# Altium schematic sheet 91302-42-067RDM1_91302-42-067RDM.schdoc.schdoc
size 127 x 111 mm
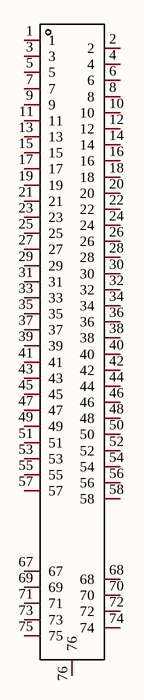
[diagram p0: 91302-42-067RDM1_91302-42-067RDM.schdoc.schdoc]

## Parts
CN?  91302-42-067RDM  [CONN-SMD_91302-32-067RDM]  (value not drawn)

## Nets

Not connected (* = marked no-connect by the designer): CN? 1 2 3 4 5 6 7 8 9 10 11 12 13 14 15 16 17 18 19 20 21 22 23 24 25 26 27 28 29 30 31 32 33 34 35 36 37 38 39 40 41 42 43 44 45 46 47 48 49 50 51 52 53 54 55 56 57 58 67 68 69 70 71 72 73 74 75 76

## Library data of the parts
CN? = 91302-42-067RDM: Manufacturer: UMaxconn(友贸); Add into BOM: yes; Connector Type: M.2; Pitch: 0.5mm; Name: 91302-42-067RDM; Symbol: 91302-42-067RDM; Device: 91302-42-067RDM; LCSC Part Name: 0.5mm P数:67P; Supplier Part: C601195; Manufacturer Part: 91302-42-067RDM; Supplier Footprint: SMD,P=0.5mm; JLCPCB Part Class: Extended Part; Datasheet: https://atta.szlcsc.com/upload/public/pdf/source/20210511/C1509730_FC1345B298657A7EB9D210DEA51B9F3C.pdf; Supplier: LCSC; Convert to PCB: yes; Number of Pins: 67P; Height Above Board: 4.2mm; Contact Material: 铜合金; Contact Plating: 金; Operating Temperature Range: -40℃~+80℃